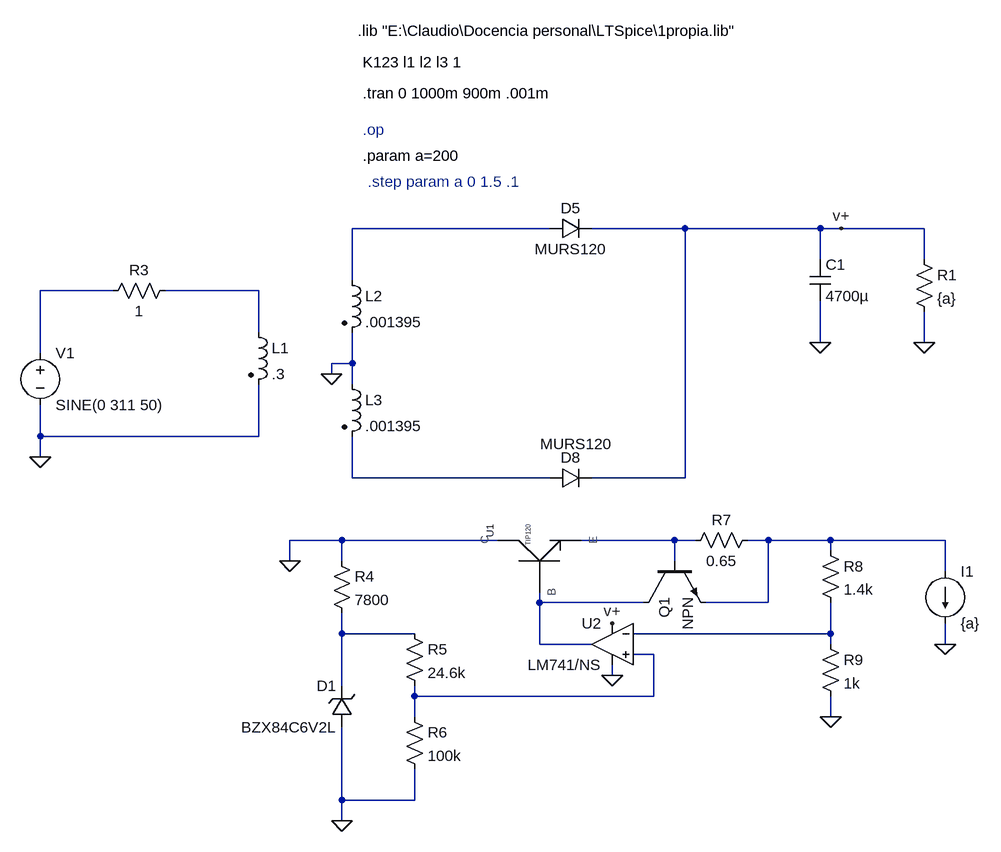
[diagram p0: schematic fuente basica 1x.asc]
fuente basica 1x.asc, the LTspice schematic file:
Version 4
SHEET 1 1284 680
WIRE 608 -256 304 -256
WIRE 816 -256 672 -256
WIRE 1024 -256 816 -256
WIRE 1056 -256 1024 -256
WIRE 1184 -256 1056 -256
WIRE 1024 -208 1024 -256
WIRE 1184 -208 1184 -256
WIRE 304 -176 304 -256
WIRE -64 -160 -176 -160
WIRE 160 -160 16 -160
WIRE 160 -96 160 -160
WIRE 1024 -80 1024 -144
WIRE 1184 -80 1184 -128
WIRE -176 -64 -176 -160
WIRE 304 -48 304 -96
WIRE 304 -48 272 -48
WIRE 272 -32 272 -48
WIRE 304 -16 304 -48
WIRE -176 64 -176 16
WIRE 160 64 160 -16
WIRE 160 64 -176 64
WIRE -176 96 -176 64
WIRE 304 128 304 64
WIRE 608 128 304 128
WIRE 816 128 816 -256
WIRE 816 128 672 128
WIRE 288 224 208 224
WIRE 528 224 288 224
WIRE 800 224 656 224
WIRE 832 224 800 224
WIRE 944 224 912 224
WIRE 1040 224 944 224
WIRE 1216 224 1040 224
WIRE 1040 240 1040 224
WIRE 208 256 208 224
WIRE 288 256 288 224
WIRE 800 256 800 224
WIRE 1216 272 1216 224
WIRE 592 320 592 304
WIRE 752 320 592 320
WIRE 944 320 944 224
WIRE 944 320 848 320
WIRE 288 368 288 336
WIRE 400 368 288 368
WIRE 1040 368 1040 320
WIRE 1040 368 736 368
WIRE 592 384 592 320
WIRE 672 384 592 384
WIRE 1040 384 1040 368
WIRE 1216 384 1216 352
WIRE 768 400 736 400
WIRE 704 432 704 416
WIRE 288 448 288 368
WIRE 400 464 400 448
WIRE 768 464 768 400
WIRE 768 464 400 464
WIRE 400 496 400 464
WIRE 1040 496 1040 464
WIRE 288 624 288 512
WIRE 400 624 400 576
WIRE 400 624 288 624
WIRE 288 656 288 624
FLAG 272 -32 0
FLAG -176 96 0
FLAG 1056 -256 v+
FLAG 704 432 0
FLAG 704 352 v+
FLAG 288 656 0
FLAG 1040 496 0
FLAG 1216 384 0
FLAG 1024 -80 0
FLAG 208 256 0
FLAG 1184 -80 0
SYMBOL voltage -176 -80 R0
WINDOW 123 24 44 Left 2
WINDOW 39 0 0 Left 0
SYMATTR InstName V1
SYMATTR Value SINE(0 311 50)
SYMBOL ind2 144 -112 R0
SYMATTR InstName L1
SYMATTR Value .3
SYMBOL ind2 288 -192 R0
SYMATTR InstName L2
SYMATTR Value .001395
SYMBOL ind2 288 -32 R0
SYMATTR InstName L3
SYMATTR Value .001395
SYMBOL res 32 -176 R90
WINDOW 0 0 56 VBottom 2
WINDOW 3 32 56 VTop 2
SYMATTR InstName R3
SYMATTR Value 1
SYMBOL cap 1008 -208 R0
SYMATTR InstName C1
SYMATTR Value 4700µ
SYMBOL diode 608 -240 R270
WINDOW 0 32 32 VTop 2
WINDOW 3 0 32 VBottom 2
SYMATTR InstName D5
SYMATTR Value MURS120
SYMBOL diode 608 144 R270
WINDOW 0 32 32 VTop 2
WINDOW 3 84 41 VBottom 2
SYMATTR InstName D8
SYMATTR Value MURS120
SYMBOL Darlington\ npn 592 256 R270
SYMATTR Value TIP120
SYMATTR InstName U1
SYMBOL res 272 240 R0
SYMATTR InstName R4
SYMATTR Value 7800
SYMBOL res 384 352 R0
SYMATTR InstName R5
SYMATTR Value 24.6k
SYMBOL res 384 480 R0
SYMATTR InstName R6
SYMATTR Value 100k
SYMBOL zener 304 512 R180
WINDOW 0 24 64 Left 2
WINDOW 3 24 0 Left 2
SYMATTR InstName D1
SYMATTR Value BZX84C6V2L
SYMBOL OpAmps\\opamp2 704 320 M0
SYMATTR InstName U2
SYMATTR Value LM741/NS
SYMBOL res 928 208 R90
WINDOW 0 0 56 VBottom 2
WINDOW 3 32 56 VTop 2
SYMATTR InstName R7
SYMATTR Value 0.65
SYMBOL npn 752 256 M90
SYMATTR InstName Q1
SYMBOL res 1024 224 R0
SYMATTR InstName R8
SYMATTR Value 1.4k
SYMBOL res 1024 368 R0
SYMATTR InstName R9
SYMATTR Value 1k
SYMBOL current 1216 272 R0
WINDOW 123 0 0 Left 0
WINDOW 39 0 0 Left 0
SYMATTR InstName I1
SYMATTR Value {a}
SYMBOL res 1168 -224 R0
SYMATTR InstName R1
SYMATTR Value {a}
TEXT 320 -464 Left 2 !.tran 0 1000m 900m .001m
TEXT 320 -512 Left 2 !K123 l1 l2 l3 1
TEXT 312 -560 Left 2 !.lib "E:\\Claudio\\Docencia personal\\LTSpice\\1propia.lib"
TEXT 320 -408 Left 2 ;.op
TEXT 320 -368 Left 2 !.param a=200
TEXT 328 -328 Left 2 ;.step param a 0 1.5 .1

The netlist it stands for:
* fuente basica 1x.asc
V1 N002 0 SINE(0 311 50)
L1 N003 0 .3
L2 N001 0 .001395
L3 0 N004 .001395
R3 N003 N002 1
C1 v+ 0 4700µ
D5 N001 v+ MURS120
D8 N004 v+ MURS120
XU1 0 N007 N005 TIP120  ; pins C B E
R4 0 N008 7800
R5 N008 N010 24.6k
R6 N010 0 100k
D1 0 N008 BZX84C6V2L
XU2 N010 N009 v+ 0 N007 LM741/NS  ; pins In+ In- V+ V- OUT
R7 N006 N005 0.65
Q1 N007 N005 N006 0 NPN
R8 N006 N009 1.4k
R9 N009 0 1k
I1 N006 0 {a}
R1 v+ 0 {a}
.model D D
.lib standard.dio
.model NPN NPN
.model PNP PNP
.lib standard.bjt
.tran 0 1000m 900m .001m
K123 l1 l2 l3 1
.lib "E:\Claudio\Docencia personal\LTSpice\1propia.lib"
* .op
.param a=200
* .step param a 0 1.5 .1
.backanno
.end